# Altium schematic sheet SCH1_MCU.SchDoc: Airsoft FAN Controller
size A4
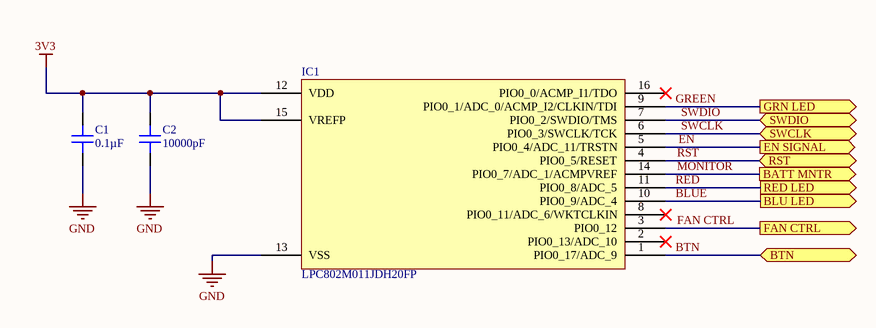
[diagram p0: SCH1_MCU.SchDoc]

## Parts
C1  0.1µF  [CAP 0402_1005]
C2  10000pF  [CAP 0402_1005]
IC1  LPC802M011JDH20FP  [NXP TSSOP-16]

## Ports
BATT MNTR (out), BLU LED (out), BTN (bidir), EN SIGNAL (out), FAN CTRL (out), GRN LED (out), RED LED (out), RST (bidir), SWCLK (bidir), SWDIO (bidir)

## Nets
3V3: C1.2 C2.2 IC1.12(VDD) IC1.15(VREFP)
GND: C1.1 C2.1 IC1.13(VSS)
BLUE: IC1.10(PIO0_9/ADC_4) ; port BLU LED
BTN: IC1.1(PIO0_17/ADC_9) ; port BTN
EN: IC1.5(PIO0_4/ADC_11/TRSTN) ; port EN SIGNAL
FAN CTRL: IC1.3(PIO0_12) ; port FAN CTRL
GREEN: IC1.9(PIO0_1/ADC_0/ACMP_I2/CLKIN/TDI) ; port GRN LED
MONITOR: IC1.14(PIO0_7/ADC_1/ACMPVREF) ; port BATT MNTR
RED: IC1.11(PIO0_8/ADC_5) ; port RED LED
RST: IC1.4(PIO0_5/RESET) ; port RST
SWCLK: IC1.6(PIO0_3/SWCLK/TCK) ; port SWCLK
SWDIO: IC1.7(PIO0_2/SWDIO/TMS) ; port SWDIO

Not connected (* = marked no-connect by the designer): IC1 2(PIO0_13/ADC_10)* 8(PIO0_11/ADC_6/WKTCLKIN)* 16(PIO0_0/ACMP_I1/TDO)*

## Notes on the sheet
- Title
- Size:
- Date:
- A4
- Number:
- Time:
- Revision:
- Sheet
- of
- File:

## Library data of the parts
C1 = CC0402KRX5R8BB104: CAP CER 0.1UF 25V X5R 0402; Manufacturer: Yageo; Tolerance: ±10%; Part Number: CC0402KRX5R8BB104; Value: 0.1µF; Applications: General Purpose; Capacitance: 0.1µF; ComponentLink1Description: Datasheet; ComponentLink1URL: https://www.yageo.com/upload/media/product/productsearch/datasheet/mlcc/UPY-GPHC_X5R_4V-to-50V_25.pdf; ComponentLink2Description: DigiKey Link; ComponentLink2URL: http://digikey.com/product-detail/en/yageo/CC0402KRX5R8BB104/311-1697-1-ND/5195599; Device Package: 0402 (1005 Metric); LastUpdated: 9/2/2020 1:01:34 AM; Lifecycle Status: Active; Minimum Order: 1; Mounting Type: Surface Mount, MLCC; Operating Temperature: -55°C ~ 85°C; Package / Case: 0402 (1005 Metric); Packaging: TapeAndReel; PartId: 12727; Part Status: Active; Price: 0.01; Series: CC; Size / Dimension: 0.039" L x 0.020" W (1.00mm x 0.50mm); Supplier 1: DigiKey; Supplier Part Number 1: 311-1697-1-ND; Temperature Coefficient: X5R; Thickness (Max): 0.022" (0.55mm); Voltage - Rated: 25V
C2 = CGA2B2X5R1E103M050BA: CAP CER 10000PF 25V X5R 0402; Manufacturer: TDK Corporation; Tolerance: ±20%; Part Number: CGA2B2X5R1E103M050BA; Value: 10000pF; Applications: Automotive; Capacitance: 10000pF; ComponentLink1Description: Datasheet; ComponentLink1URL: https://product.tdk.com/info/en/catalog/datasheets/mlcc_automotive_general_en.pdf?ref_disty=digikey; ComponentLink2Description: DigiKey Link; ComponentLink2URL: http://digikey.com/product-detail/en/tdk-corporation/CGA2B2X5R1E103M050BA/445-12174-1-ND/3953840; Device Package: 0402 (1005 Metric); LastUpdated: 9/2/2020 1:02:10 AM; Lifecycle Status: Active; Minimum Order: 1; Mounting Type: Surface Mount, MLCC; Operating Temperature: -55°C ~ 85°C; Package / Case: 0402 (1005 Metric); Packaging: TapeAndReel; PartId: 8092; Part Status: Active; Price: 0.01; Ratings: AEC-Q200; Series: CGA; Size / Dimension: 0.039" L x 0.020" W (1.00mm x 0.50mm); Supplier 1: DigiKey; Supplier Part Number 1: 445-12174-1-ND; Temperature Coefficient: X5R; Thickness (Max): 0.022" (0.55mm); Voltage - Rated: 25V
IC1 = NXP LPC802 16PIN: Integrated CIrcuit; Price: 1.45